# EAGLE design Adafrruit Bluefruit LE USB Friend CP2102N (EAGLE 9.6.2)
COMPANY: ADAFRUIT INDUSTRIES; DRAWN: KTOWN; REV: C
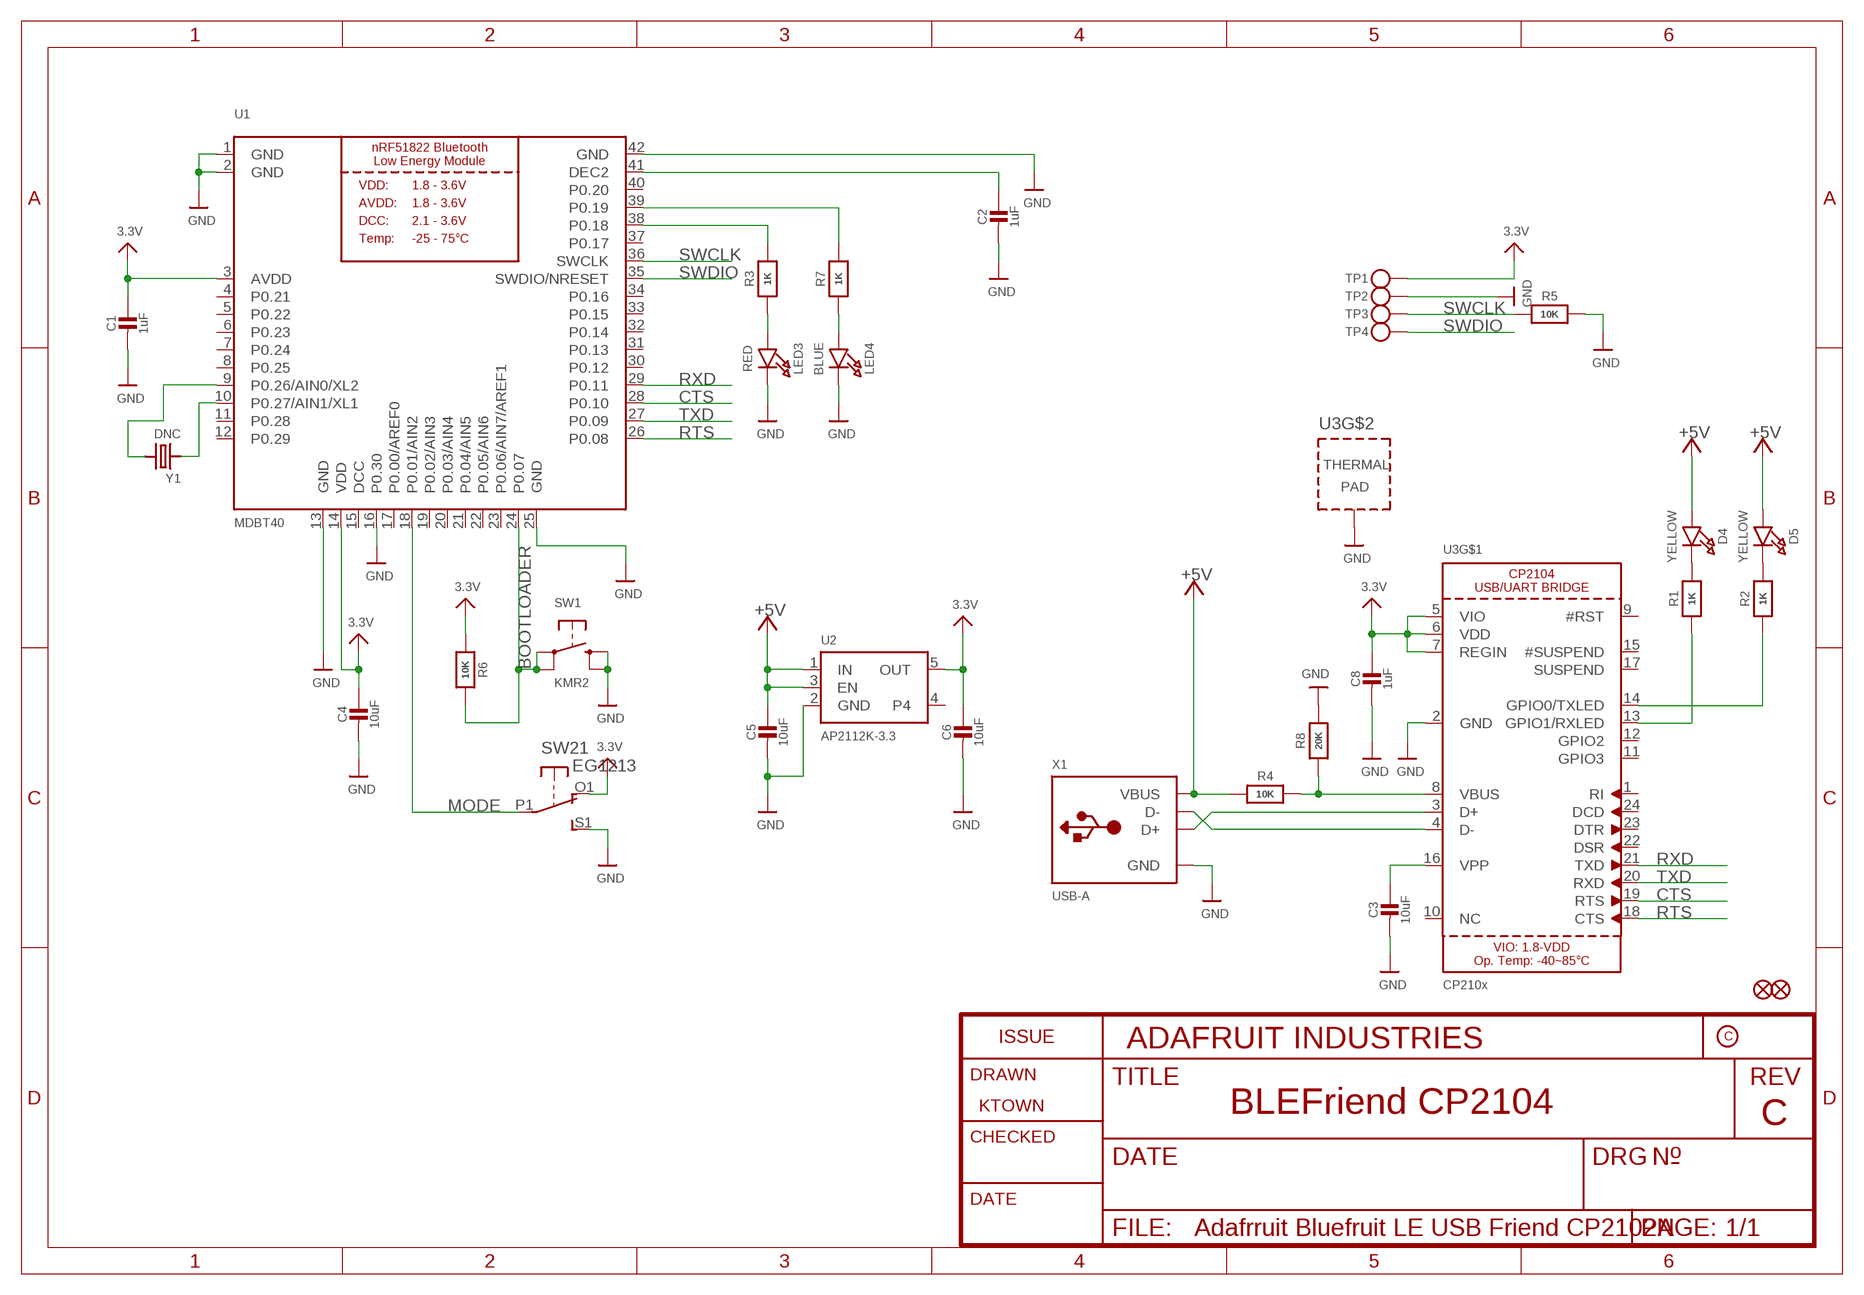
[diagram p0: schematic, sheet 1]

## Parts
C1  1uF  CAP_CERAMIC0603_NO  [0603-NO]
C2  1uF  CAP_CERAMIC0603_NO  [0603-NO]
C3  10uF  CAP_CERAMIC0805-NOOUTLINE  [0805-NO]
C4  10uF  CAP_CERAMIC0805-NOOUTLINE  [0805-NO]
C5  10uF  CAP_CERAMIC0805-NOOUTLINE  [0805-NO]
C6  10uF  CAP_CERAMIC0805-NOOUTLINE  [0805-NO]
C8  1uF  CAP_CERAMIC0603_NO  [0603-NO]
D4  YELLOW  LED0805_NOOUTLINE  [CHIPLED_0805_NOOUTLINE]
D5  YELLOW  LED0805_NOOUTLINE  [CHIPLED_0805_NOOUTLINE]
FID1  FIDUCIAL_1MM  [FIDUCIAL_1MM]
FID2  FIDUCIAL_1MM  [FIDUCIAL_1MM]
LED3  RED  LED0805_NOOUTLINE  [CHIPLED_0805_NOOUTLINE]
LED4  BLUE  LED0805_NOOUTLINE  [CHIPLED_0805_NOOUTLINE]
R1  1K  RESISTOR_0603_NOOUT  [0603-NO]
R2  1K  RESISTOR_0603_NOOUT  [0603-NO]
R3  1K  RESISTOR_0603_NOOUT  [0603-NO]
R4  10K  RESISTOR_0603_NOOUT  [0603-NO]
R5  10K  RESISTOR_0603_NOOUT  [0603-NO]
R6  10K  RESISTOR_0603_NOOUT  [0603-NO]
R7  1K  RESISTOR_0603_NOOUT  [0603-NO]
R8  20K  RESISTOR_0603_NOOUT  [0603-NO]
SW1  KMR2  SWITCH_TACT_SMT4.6X2.8  [BTN_KMR2_4.6X2.8]
SW2  EG1213  DPDT-EG1390  [EG1390]
TP1  TESTPOINTROUND2MM  [TESTPOINT_ROUND_2MM]
TP2  TESTPOINTROUND2MM  [TESTPOINT_ROUND_2MM]
TP3  TESTPOINTROUND2MM  [TESTPOINT_ROUND_2MM]
TP4  TESTPOINTROUND2MM  [TESTPOINT_ROUND_2MM]
U1  MDBT40  NRF51822_MODULE_MDBT40  [BLE_MODULE_RAYTAC_MDBT40]
U2  AP2112K-3.3  VREG_SOT23-5  [SOT23-5]
U3  CP210x  CP2104  [QFN24_4MM_SMSC]
X1  USB-A  USB_TYPEA_CLIENTTHM  [USB_A-THM]
Y1  DNC  CRYSTAL2.0X6.0_32.768  [CRYSTAL_CYL_2X6MM_SMT]

## Nets
3.3V: C1.1 C4.1 C6.1 C8.1 R6.1 SW2.O1(1:O) TP1.P$1 U1.3(AVDD) U1.14(VDD) U2.5(OUT) U3.5(VIO) U3.6(VDD) U3.7(REGIN)
+5V [usbvcc]: C5.1 D4.A D5.A R4.1 U2.1(IN) U2.3(EN) X1.VBUS
BOOTLOADER: R6.2 SW1.A'(P1) SW1.A(P) U1.24(P0.07)
CTS: U1.28(P0.10) U3.19(RTS)
DEC2: C2.1 U1.41(DEC2)
GND: C1.2 C2.2 C3.2 C4.2 C5.2 C6.2 C8.2 LED3.C LED4.C R5.2 R8.2 SW1.B'(S1) SW1.B(S) SW2.S1(1:S) TP2.P$1 U1.1(GND) U1.2(GND) U1.13(GND) U1.16(P0.30) U1.25(GND) U1.42(GND) U2.2(GND) U3.2(GND) U3.THERM(TP) X1.GND
MODE: SW2.P1(1:P) U1.18(P0.01/AIN2)
N$1: U3.4(D-) X1.D-
N$2: D4.C R1.2
N$3: LED3.A R3.1
N$4: C3.1 U3.16(VPP)
N$5: R2.1 U3.14(GPIO0/TXLED)
N$6: D5.C R2.2
N$7: R4.2 R8.1 U3.8(VBUS)
N$8: U3.3(D+) X1.D+
N$10: R3.2 U1.38(P0.18)
N$11: R7.2 U1.39(P0.19)
N$12: LED4.A R7.1
N$13: U1.9(P0.26/AIN0/XL2) Y1.2
N$14: U1.10(P0.27/AIN1/XL1) Y1.1
N$15: R1.1 U3.13(GPIO1/RXLED)
RTS: U1.26(P0.08) U3.18(CTS)
RXD: U1.29(P0.11) U3.21(TXD)
SWCLK: R5.1 TP3.P$1 U1.36(SWCLK)
SWDIO: TP4.P$1 U1.35(SWDIO/NRESET)
TXD: U1.27(P0.09) U3.20(RXD)
Unconnected: SW2.O2(2:O) SW2.P2(2:P) SW2.S2(2:S) U1.4(P0.21) U1.5(P0.22) U1.6(P0.23) U1.7(P0.24) U1.8(P0.25) U1.11(P0.28) U1.12(P0.29) U1.17(P0.00/AREF0) U1.19(P0.02/AIN3) U1.20(P0.03/AIN4) U1.21(P0.04/AIN5) U1.22(P0.05/AIN6) U1.23(P0.06/AIN7/AREF1) U1.30(P0.12) U1.31(P0.13) U1.32(P0.14) U1.33(P0.15) U1.34(P0.16) U1.37(P0.17) U1.40(P0.20) U2.4 U3.1(RI) U3.9(#RST) U3.10(NC) U3.11(GPIO3) U3.12(GPIO2) U3.15(#SUSPEND) U3.17(SUSPEND) U3.22(DSR) U3.23(DTR) U3.24(DCD)

## Notes on the sheet
- BLEFriend CP2104

## Power pins joined to a net without a drawn wire
DCC: U1.15(DCC)

## Library data of the parts
C1-C6 C8 = microbuilder:CAP_CERAMIC: Ceramic Capacitors For new designs, use the packages preceded by an '_' character since they are more reliable: The following footprints should be used on most boards: _0402 - Standard footprint for regular board layouts _0603 - Standard footprint for regular board layouts _0805 - Standard footprint for regular board layouts _1206 - Standard footprint for regular board layouts For extremely tight-pitch boards where space is at a premium, the following 'micro-pitch' footprints can be used (smaller pads, no silkscreen outline, etc.): _0402MP - Micro-pitch footprint for very dense/compact boards _0603MP - Micro-pitch footprint for very dense/compact boards _0805MP - Micro-pitch footprint for very dense/compact boards _1206MP - Micro-pitch footprint for very dense/compact boards
D4 D5 LED3 LED4 = microbuilder:LED: LED 0603 - 0603 Surface Mount Package 2mA: Green LED - Low Power (3.9mcd, 2ma, 1.7Vf) - Digikey: 475-2709-2-ND Orange LED - Low Power (9.8mcd, 2ma, 1.8Vf) - Digikey: 475-1194-2-ND Red LED - Low Power (5mcd, 2ma, 1.8Vf) - Digikey: 475-1195-2-ND Yellow LED - Low Power (7mcd, 2ma, 1.8Vf) - Digikey: 475-1196-2-ND 5mA: Blue LED - Low Power (17mcd, 5ma, 2.9Vf) - Digikey: LNJ937W8CRACT-ND 0805 - 0805 Surface Mount Package 2mA: Red LED (8.8mcd, 2mA, 1.8Vf, Clear) - Low Power [Digikey: 475-2510-1-ND] Green LED (5mcd, 2mA, 1.8Vf, Clear) - Low Power [Digikey: 475-2730-1-ND] Yellow LED (11.3mcd, 2mA, 1.8Vf, Clear) - Low Power [Digikey: 475-2555-1-ND] 20mA: Red LED (104mcd, 20mA, Diffused) - LS R976 [Digikey: 475-1278-6-ND] Red LED (12mcd, 20mA, 2.0Vf, Clear) - APT2012EC [Digikey: 754-1128-1-ND] Green LED (15mcd, 20mA, 2.2Vf, Clear) - APT2012GC [Digikey: 754-1131-1-ND] Orange LED (160mcd, 20mA, 2.1Vf, Clear) - APT2012SECK [Digikey: 754-1130-1-ND] 1206 - 1206 Surface Mount Package Green LED (26mcd, 20mA, Diffused) - LG N971 [Digikey: 475-1407-6-ND] Red LED (15mcd, 20mA, Diffused) - LH N974 [Digikey: 475-1416-6-ND] Cree - Cree High-Power Surface Mount LEDs XPEBWT-L1-0000-00D50 - White 111lm 350mA 2.9Vf 6200K 110° XTEAWT-00-0000-00000LEE3 - White 114lm 350mA 2.85Vf 5000K 115° Everlight - Everlight 45-21 Series Surface Mount LEDs 45-21/QK2C-B2832AC2CB2/2T - Warm White 2000mcd 20mA 3.25Vf 3050K 120° 45-21/LK2C-B38452C4CB2/2T - Nuetral White 2000mcd 20mA 3.25Vf 4150K 120° 45-21/LK2C-B50634C6CB2/2T - Cold White 2200mcd 20mA 3.25Vf 5650K 120° PLCC2 Reverse Mount LS T77K-J1L2-1-0-2-R18-Z - Red 11.25mcd 2mA 1.8Vf 630nm 120° LO T77K-L1M2-24-Z - Orange 19.6mcd 2mA 1.8Vf 606nm 120° LY T77K-K2M1-26-Z - Yellow 15.7mcd 2mA 1.8Vf 587nm 120°
FID1 FID2 = microbuilder:FIDUCIAL: Fiducial Alignment Points Various fiducial points for machine vision alignment.; BOM: EXCLUDE
R1-R8 = microbuilder:RESISTOR: Resistors For new designs, use the packages preceded by an '_' character since they are more reliable: The following footprints should be used on most boards: _0402 - Standard footprint for regular board layouts _0603 - Standard footprint for regular board layouts _0805 - Standard footprint for regular board layouts _1206 - Standard footprint for regular board layouts For extremely tight-pitch boards where space is at a premium, the following 'micro-pitch' footprints can be used (smaller pads, no silkscreen outline, etc.): _0402MP - Micro-pitch footprint for very dense/compact boards _0603MP - Micro-pitch footprint for very dense/compact boards _0805MP - Micro-pitch footprint for very dense/compact boards _1206MP - Micro-pitch footprint for very dense/compact boards
SW1 = adafruit_electromech:SWITCH_TACT_SMT: SMT Tact Switches 6x6mm - Digikey: P12940SCT-ND KMR2 (4.6x2.8mm) - Digikey: 401-1426-1-ND EVQ-PQHB55 - Light Touch, 160GF (4.5x4.5mm) - Digikey: P8090SCT-ND KMT0 - KMT021 NGJ LHS (etc.) IP68/Waterproof - Digikey: CKN10289CT-ND
SW2 = adafruit:DPDT
TP1-TP4 = microbuilder:TESTPOINT: Test Point Various test points for characterisation and PCB testing TESTPOINT_SMT - Compact Surface Mount Test Point [Digikey: 5016KTR-ND]
U1 = adafruit_micro:NRF51822_MODULE_MDBT40: nRF51822 Bluetooth Low Energy Module
U2 = adafruit_power:VREG_SOT23-5: SOT23-5 Fixed Voltage Regulators Part Current Out V Out V In V Dropout θJA (°C/W) TJ (°C) Digikey Part No. ADP121 150mA 3.3V 3.4-5.5V 0.09V @ 150mA -- -- ADP121-AUJZ33R7CT-ND ADP121 150mA 3.0V 3.1-5.5V 0.09V @ 150mA -- -- ADP121-AUJZ30R7CT-ND ADP122 300mA 3.3V 3.4-5.5V 0.085V @ 300mA -- -- ADP122AUJZ-3.3-R7CT-ND ADP1712 300mA 3.3V 3.5-5.5V 0.17V @ 300mA -- -- ADP1712AUJZ-3.3-R7TR-ND AP7311 (Low Cost) 150mA 3.3V 3.5-6V 0.15V @ 150mA -- -- AP7311-33WG-7DICT-ND LD39015M18R 150mA 1.8V 1.9V-5.5V 0.08V @ 100mA -- -- 497-6977-1-ND LP2985A-33DBVR 150mA 3.3V 3.3-16V 0.28V @ 150mA 206 150 296-18479-1-ND MCP1824T-3302E/OT 300mA 3.3V 3.5V-6V 0.2V @ 300mA -- -- MCP1824T-3302E/OTCT-ND MIC5205-2.5YM5 TR 150mA 2.5V 2.7-16V 0.165V @ 150mA -- -- 576-1257-2-ND MIC5205-3.0YM5 TR 150mA 3.0V 3.2V-16V 0.165V @ 150mA -- -- 576-1258-2-ND MIC5205-3.3YM5 TR 150mA 3.3V 3.5V-16V 0.165V @ 150mA -- -- 576-1259-2-ND TPS780330220 150mA 3.3V+2.2V 3.6-5.5V 250mV Max -- -- 296-23332-1-ND TDA3663/N1,135 100mA 3.3V 3.5-45V 0.18V @ 50mA -- -- 568-5343-1-ND Max operating temp can be calculated using θJA, TJ (max junction temperature), and power in watts. Set the "Maximum Ambient Temperature" until it reaches TJ ("Max Junction Temperature"), which is the absolute limit for safe use of the regulator: Heat Sink Temperature Calculator <http://www.daycounter.com/Calculators/Heat-Sink-Temperature-Calculator.phtml> For example, With 12V source into a 3.3V LP2985 and a 30mA load, we are dissipating (12V-3.3V) * 0.03A = 0.261W. With a θJA of 206 °C/W, a TJ of 150°C, and 261mW we can safely use the chip without a heat sink up to 75°C (=147.1°C Junction Temperature).
U3 = microbuilder:CP2104: CP2104 - USB to UART Bridge VDD Output: 3.45V
X1 = adafruit_electromech:USB_TYPEA: USB - Type A Connectors Male types stick out and are inserted into a PC or matching females parts (these are the connectors used on USB Memory Sticks, etc.). Female parts are generally used for USB Host and accept a male-type connector. SMT - 4UCON: 10017 PTHFML - Digikey: 609-1045-ND, 4UCon: 05241 PCB - Use 2.0mm thick PCBs with this footprint
Y1 = microbuilder:CRYSTAL: Crystals HC49UP - Surface Mount Crystal 4.0MHz 18pF +/-30ppm Surface Mount Crystal [Digikey: 535-9857-1-ND] 12.0 MHz Surface Mount Crystal [Digikey: 535-9869-6-ND] 25.0 MHz Surface Mount Crystal [Digikey: 535-9078-1-ND] 2.5 x 2.0mm - MEMs SMT Crystal 16.0 MHz 10pF 20ppm 2.5 x 2.0mm Crystal [Digikey -40-85°C: 535-10923-1-ND] 3.2 x 2.5mm - MEMs SMT Crystal 12.0 MHz 8pF 15ppm 3.2 x 2.5mm Crystal [Digikey: -10-70°C: 644-1047-1-ND -40-125°C: 644-1128-1-ND] 40~85°C cheaper: 644-1173-6-ND 16.0 MHz 8pF 15ppm 3.2 x 2.5mm Crystal [Digikey: -10-70°C: 644-1049-1-ND -40-125°C: 644-1129-2-ND]-40~85°C cheaper: 644-1175-6-ND 16.0 MHz 10pF 10ppm 3.2 x 2.5mm Crystal [Digikey: 644-1100-1-ND] 27.12 MHz 18pF 30ppm 3.2 x 2.5mm Crystal [Digikey: 887-1424-1-ND] 27.12MHz 10pF 10ppm 3.2 x 2.5mm Crystal [Digikey: 887-1329-1-ND] 4.9 x 1.8mm - MEMs SMT Crystal 32.768 KHz 12.5pF 20ppm 4.9 x 1.8mm Crystal [Digikey: SE2415CT-ND] 8.0 x 3.8mm - Surface Mount Crystal 32.768kHz 12.5pF 20ppm -40°C-85°C [Digikey: 535-9166-2-ND] Cylinder 32.768KHz Cylinder Crystal (2x6mm body) [Ex. Digikey: 300-8341-2-ND]

## Net classes
2 gnd: width 0.305 mm, drill 0.483 mm, clearance 0.203 mm
3 usbvcc: width 0.305 mm, drill 0.483 mm, clearance 0.203 mm

## Board
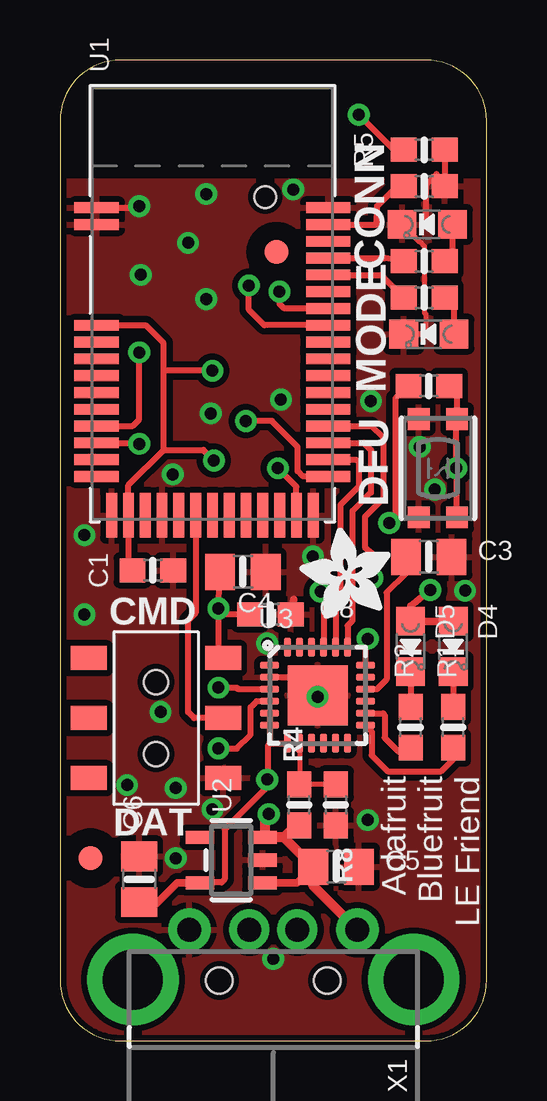
[diagram p1: board, top side]
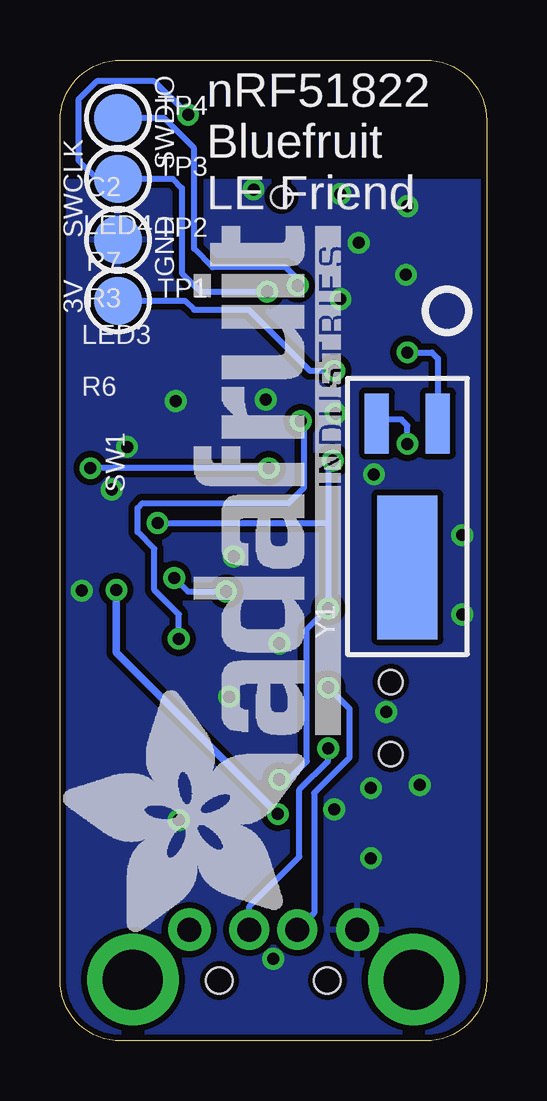
[diagram p2: board, bottom side, seen from below]

Size 17.78 x 40.89 mm. Coordinates in mm from the lower left corner, seen from the top.
Outline: 17.78,2.54 17.78,38.35 arc90 15.24,40.89 2.54,40.89 arc90 0,38.35 0,2.54 arc90 2.54,0 15.24,0 arc90 17.78,2.54
Copper layers (1*16): Top 0.035mm / dielectric 1.5mm / Bottom 0.035mm
Design rules "adafruit": minimum track width 8mil, minimum drill 15.5mil, track to track 8mil, track to pad 8mil, pad to pad 8mil, via to via 8mil, smd to smd 8mil, copper to edge 10mil, drill to drill 8mil, minimum pad ring 10mil, minimum via ring 8mil, stop-mask expansion 2mil, vias tented up to drill 20mil, thermal gap 10mil

### Footprints (pad centres in the part's own frame; a part is rotated, then mirrored left to right if it is on the bottom)
0603-NO = smd 1.075 x 1: 1 -0.85,0; 2 0.85,0
0805-NO = smd 1.24 x 1.5: 1 -0.95,0; 2 0.95,0
CHIPLED_0805_NOOUTLINE = smd 1.2 x 1.2: A 0,-1.05; C 0,1.05
FIDUCIAL_1MM = smd 1 x 1: 1 0,0
BTN_KMR2_4.6X2.8 = smd 0.9 x 0.9: A 2.05,0.8; A' -2.05,0.8; B 2.05,-0.8; B' -2.05,-0.8
EG1390 = smd 1 x 1.5: O1 -2.5,2.8; O2 -2.5,-2.8; P1 0,2.8; P2 0,-2.8; S1 2.5,2.8; S2 2.5,-2.8 | hole 1: 1.5,0; -1.5,0
TESTPOINT_ROUND_2MM = smd 2 x 2: P$1 0,0
BLE_MODULE_RAYTAC_MDBT40 = smd 1.85 x 0.45: 1 -4.825,4; 2 -4.825,3.3; 3 -4.825,-0.9; 4 -4.825,-1.6; 5 -4.825,-2.3; 6 -4.825,-3; 7 -4.825,-3.7; 8 -4.825,-4.4; 9 -4.825,-5.1; 10 -4.825,-5.8; 11 -4.825,-6.5; 12 -4.825,-7.2; 26 4.825,-7.2; 27 4.825,-6.5; 28 4.825,-5.8; 29 4.825,-5.1; 30 4.825,-4.4; 31 4.825,-3.7; 32 4.825,-3; 33 4.825,-2.3; 34 4.825,-1.6; 35 4.825,-0.9; 36 4.825,-0.2; 37 4.825,0.5; 38 4.825,1.2; 39 4.825,1.9; 40 4.825,2.6; 41 4.825,3.3; 42 4.825,4 | smd 0.45 x 1.85: 13 -4.2,-8.825; 14 -3.5,-8.825; 15 -2.8,-8.825; 16 -2.1,-8.825; 17 -1.4,-8.825; 18 -0.7,-8.825; 19 0,-8.825; 20 0.7,-8.825; 21 1.4,-8.825; 22 2.1,-8.825; 23 2.8,-8.825; 24 3.5,-8.825; 25 4.2,-8.825 | hole 0.9: 2.2,4.45
SOT23-5 = smd 0.55 x 1.2: 1 -0.95,-1.3; 2 0,-1.3; 3 0.95,-1.3; 4 0.95,1.3; 5 -0.95,1.3
QFN24_4MM_SMSC = smd 0.8 x 0.28: 1 -2,1.25; 2 -2,0.75; 3 -2,0.25; 4 -2,-0.25; 5 -2,-0.75; 6 -2,-1.25; 13 2,-1.25; 14 2,-0.75; 15 2,-0.25; 16 2,0.25; 17 2,0.75; 18 2,1.25 | smd 0.28 x 0.8: 7 -1.25,-2; 8 -0.75,-2; 9 -0.25,-2; 10 0.25,-2; 11 0.75,-2; 12 1.25,-2; 19 1.25,2; 20 0.75,2; 21 0.25,2; 22 -0.25,2; 23 -0.75,2; 24 -1.25,2 | smd 2.5 x 2.5: THERM 0,0
USB_A-THM = drill 1 pad 1.676: D+ 1,-2.1; D- -1,-2.1 | drill 1 pad 1.778: GND 3.5,-2.1; VBUS -3.5,-2.1 | drill 2.5 pad 3.81: MNT1 -5.85,-0.02; MNT2 5.85,-0.02 | hole 1.1: -2.25,0.022; 2.25,0.022
CRYSTAL_CYL_2X6MM_SMT = smd 2.5 x 1: 1 2.125,1.27; 2 2.125,-1.27 | smd 6 x 2.5: CYLINDER -3.875,0

### Placement (x,y rotation side)
C1  3.87,19.62 0 top
C2  15.18,35.62 0 top
C3  15.37,20.18 0 top
C4  7.62,19.56 0 top
C5  11.51,7.26 0 top
C6  3.3,6.74 90 top
C8  8.76,17.78 0 top
D4  16.38,16.45 180 top
D5  14.61,16.45 180 top
FID1  9.02,32.89 0 top
FID2  1.27,7.62 0 top
LED3  15.37,29.46 90 top
LED4  15.3,34.04 90 top
R1  16.38,13.08 90 top
R2  14.61,13.08 90 top
R3  15.18,30.99 180 top
R4  9.97,9.84 90 top
R5  15.18,37.15 0 top
R6  15.37,27.3 0 top
R7  15.18,32.51 180 top
R8  11.49,9.84 270 top
SW1  15.75,23.88 270 top
SW2  4,13.46 270 top
TP1  15.37,30.86 0 bottom
TP2  15.37,33.4 0 bottom
TP3  15.37,35.94 0 bottom
TP4  15.37,38.48 0 bottom
U1  6.35,30.73 0 top
U2  7.14,7.54 90 top
U3  10.73,14.41 0 top
U$16  [PCBFEAT-REV-040]  1.66,30.43 0 bottom
U$22  [ADAFRUIT_TEXT_30MM]  6.1,4.32 90 bottom
U$31  [ADAFRUIT_3.5MM]  13.78,17.59 90 top
X1  8.89,2.54 180 top
Y1  3.3,23.62 90 bottom

### Tracks (layer width: path | path; a pad name or v marks a point on that pad's centre or on a via)
3.3V  (via drill 0.5)
  Top 0.254: R6.1 13.97,26.8 13.97,21.84 v13.72,21.59 | v6.6,18.03 C4.1 | v6.6,18.03 6.6,16.16 SW2.O1 | C1.1 2.85,19.87 U1.14 2.85,23.17 4.32,24.64 | U1.3 3.57,29.83 4.32,29.08 4.32,27.94 | 4.32,24.64 4.32,27.94 | 4.32,24.64 5.97,24.64 v6.41,24.19 | v6.35,27.94 4.32,27.94 | C8.1 6.86,17.78 v6.6,18.03 | U3.5 U3.6 8.73,12.45 8.76,12.41 | 8.67,10.89 v8.64,10.9 | 8.76,12.41 U3.7 | 8.67,10.89 8.67,10.64 6.86,8.83 6.86,6.73 6.73,6.6 5.85,6.6 U2.5 | 8.76,12.41 8.67,12.32 8.67,10.89
  Top 0.305: U2.5 4.88,6.59 4,5.71 3.38,5.71 C6.1
  Bottom 0.254: v13.72,21.59 6.6,21.59 | 6.6,21.59 v6.6,18.03 7.49,17.14 7.49,11.66 8.26,10.9 v8.64,10.9 | 6.6,21.59 6.6,24 v6.41,24.19 | v6.35,27.94 7.37,27.94 9.91,30.48 12.19,30.48 12.57,30.86 TP1.P$1
+5V  (via drill 0.5)
  Top 0.305: U2.1 9.89,6.59 C5.1 | D4.A D5.A 14.61,18.14 v15.43,18.8
  Top 0.406: X1.VBUS 10.56,6.47 C5.1 9.33,8.49 | v8.7,9.46 8.52,9.28 8.52,8.6 8.63,8.49 U2.3 9.33,8.49 | R4.1 9.82,8.99 9.33,8.49
  Bottom 0.305: v15.43,18.8 15.43,16.19 v8.7,9.46
BOOTLOADER  (via drill 0.5)
  Top 0.254: SW1.A 16.51,21.86 v16.51,23.88 16.51,25.89 SW1.A' 16.55,27.27 R6.2 | U1.24 9.85,23.11 v9.08,23.88
  Bottom 0.254: v9.08,23.88 v16.51,23.88
CTS
  Top 0.254: U1.28 12.66,24.93 12.95,24.64 12.95,22.86 12.19,22.1 12.19,17.53 11.98,17.32 U3.19
DEC2
  Top 0.254: U1.41 13.21,34.03 13.21,34.8 13.97,35.56 13.97,35.43 14.14,35.43 C2.1
GND  (via drill 0.5)
  Top 0.203: LED4.C 14.97,33.32 14.99,33.32 15.18,33.12 15.18,30.36 15.24,30.31 15.24,29.59 15.11,29.46 LED3.C
  Top 0.254: U1.1 3.24,34.73 v3.3,34.8 | 10.66,14.27 10.27,14.66 9.61,15.16 U3.2 | 10.66,14.27 10.44,14.04 10.66,13.83 | U3.THERM v10.73,14.36 10.66,14.27 | R5.2 C2.2 15.69,36.14 15.24,35.69 15.24,34.04
  Top 0.305: C8.2 9.73,18.39
  Bottom 0.254: v3.3,34.8 3.3,34.54
  other vias: 3.37,31.94 6.1,35.31 9.72,35.5 12.95,26.67 4.83,7.62 6.35,9.65 12.83,9.21 10.54,20.19 1.02,21.08 1.02,17.78 2.79,10.67 4.19,13.72 4.83,10.54 8.89,3.43 16.88,18.77 14.99,24.77 8.64,16.57 5.33,33.27 6.1,30.92 6.29,26.16 9.21,26.73 4.7,23.62 15.62,22.99
  pour Bottom (isolate 0.254): 0,0 17.78,0 17.78,35.81 0,35.81
  pour Top (isolate 0.254): 0,0 17.78,0 17.78,35.81 0,35.81
MODE
  Top 0.254: SW2.P1 5.59,13.46 5.33,13.72 5.33,17.53 5.65,17.84 U1.18
N$1  (via drill 0.5)
  Top 0.254: v6.6,12.19 7.37,12.19 7.94,12.76 7.94,13.91 8.2,14.16 U3.4
  Bottom 0.254: X1.D- 9.89,5.6 7.81,7.68 7.81,10.48 6.6,11.68 v6.6,12.19
N$2
  Top 0.254: D4.C R1.2
N$3
  Top 0.254: LED3.A 16.42,30.6 R3.1
N$4
  Top 0.254: C3.1 14.42,19.5 13.61,18.69 13.61,15.07 13.2,14.66 U3.16
N$5
  Top 0.254: U3.14 13.45,13.66 13.53,13.59 13.53,12.64 14.09,12.07 R2.1
N$6
  Top 0.254: D5.C R2.2
N$7
  Top 0.203: U3.8 9.98,10.7 R4.2 R8.1
N$8  (via drill 0.5)
  Top 0.254: v6.6,14.73 7.37,14.73 7.43,14.66 U3.3
  Bottom 0.254: X1.D+ 7.19,5.34 7.19,10.34 5.71,11.81 5.71,13.84 v6.6,14.73
N$10
  Top 0.254: U1.38 13.38,31.93 R3.2
N$11
  Top 0.254: R7.2 13.56,32.63 U1.39
N$12
  Top 0.254: LED4.A 16.35,32.77 R7.1
N$13  (via drill 0.5)
  Top 0.254: U1.9 3.03,25.63 3.3,25.91 v3.3,28.7
  Bottom 0.254: v3.3,28.7 2.29,28.7 2.03,28.45 Y1.2
N$14  (via drill 0.5)
  Top 0.254: U1.10 3.01,24.93 v3.3,24.89
  Bottom 0.254: v3.3,24.89 3.3,25.65 3.56,25.91 4.16,25.91 Y1.1
N$15
  Top 0.254: U3.13 12.99,12.91 12.99,11.91 13.65,11.24 15.88,11.24 16.38,11.75 R1.1
RTS  (via drill 0.5)
  Top 0.254: U3.18 12.73,16.73 v12.83,16.76 | U1.26 10.12,23.53 9.91,23.75 9.91,24.77 8.83,25.84 v7.75,25.84
  Bottom 0.254: v12.83,16.76 12.83,17.78 13.84,18.8 13.84,20.51 14.54,21.21 14.54,22.23 14.35,22.42 8.26,22.42 7.62,23.05 7.62,25.72 v7.75,25.84
RXD  (via drill 0.5)
  Top 0.254: U1.29 12.97,25.63 13.46,25.15 13.46,22.61 12.7,21.84 12.7,20.57 13.02,20.32 v13.02,19.3 | U3.21 10.98,18.61 v10.86,18.73
  Bottom 0.254: v13.02,19.3 12.45,18.73 v10.86,18.73
SWCLK  (via drill 0.5)
  Top 0.254: v9.14,31.24 9.14,30.73 9.34,30.53 U1.36 | R5.1 13.91,37.15 v12.45,38.61
  Bottom 0.254: v9.14,31.24 11.94,31.24 12.7,32 12.7,35.56 13.08,35.94 TP3.P$1 16.26,35.94 17.02,36.7 17.02,39.24 16.26,40.01 13.84,40.01 v12.45,38.61
SWDIO  (via drill 0.5)
  Top 0.254: U1.35 8.52,29.83 7.87,30.48 v7.87,31.5
  Bottom 0.254: v7.87,31.5 7.87,31.75 8.38,32.26 11.43,32.26 12.19,33.02 12.19,37.21 13.46,38.48 TP4.P$1
TXD
  Top 0.254: U1.27 12.34,24.23 12.45,24.13 12.45,23.11 11.68,22.35 11.68,18.16 11.48,17.96 U3.20

### Text on the board
tPlace: CONN | MODE | DFU | CMD | Adafruit / Bluefruit / LE Friend | DAT
bPlace: SWDIO | SWCLK | nRF51822 / Bluefruit / LE Friend | GND | 3V
Document: Designed for USB-7201-C (Digikey 377-1735-ND)